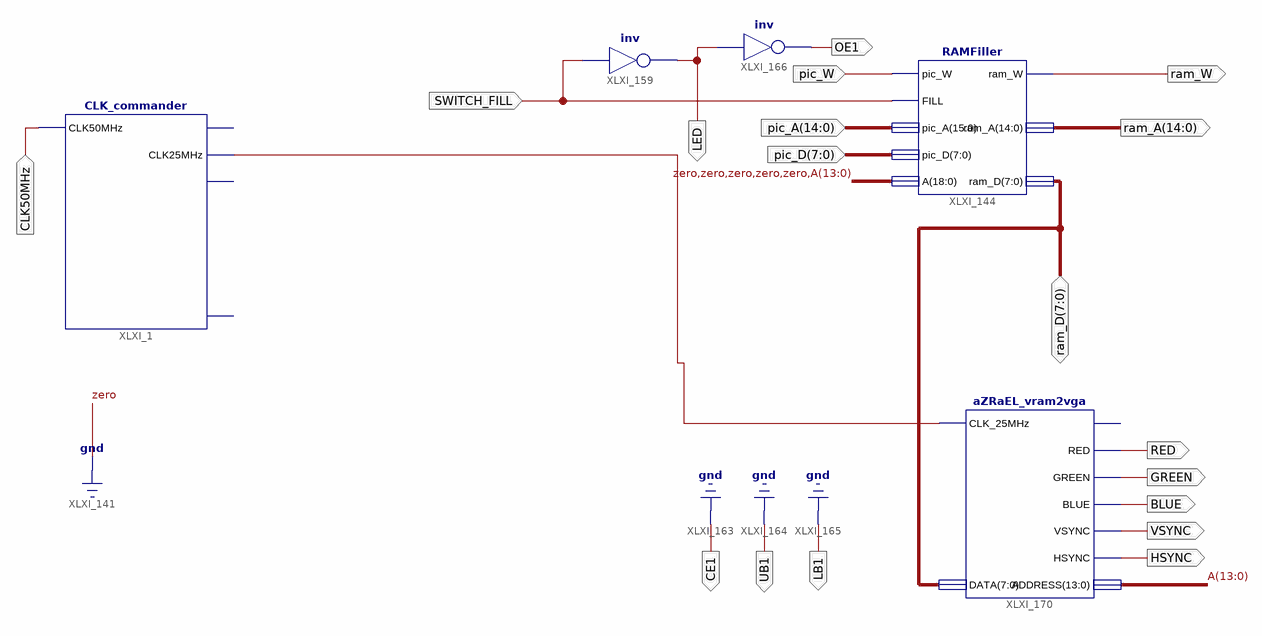
[diagram p0: schematic sheet 1]
// Xilinx ISE schematic externalVRAM2VGA.sch (spartan3) as structural Verilog: 5 symbols, 18 ports
module externalVRAM2VGA (
  input  pic_W,
  input  [14:0] pic_A,
  input  [7:0] pic_D,
  input  CLK50MHz,
  input  SWITCH_FILL,
  inout  [7:0] ram_D,
  output CE1,
  output UB1,
  output LB1,
  output OE1,
  output LED,
  output ram_W,
  output [14:0] ram_A,
  output RED,
  output GREEN,
  output BLUE,
  output VSYNC,
  output HSYNC
);

  wire XLXN_552;
  wire [13:0] A;

  CLK_commander XLXI_1 (.CLK50MHz(CLK50MHz), .CLK25MHz(XLXN_552));  // open: CLK100MHz, CLK1MHz, CLK4MHz
  not XLXI_159 (LED, SWITCH_FILL);
  not XLXI_166 (OE1, LED);
  RAMFiller XLXI_144 (
    .pic_W(pic_W), .FILL(SWITCH_FILL), .pic_A(pic_A), .pic_D(pic_D), .A({{5{1'b0}}, A}), .ram_W(ram_W),
    .ram_A(ram_A), .ram_D(ram_D));
  aZRaEL_vram2vga XLXI_170 (
    .CLK_25MHz(XLXN_552), .DATA(ram_D), .RED(RED), .GREEN(GREEN), .BLUE(BLUE), .VSYNC(VSYNC), .HSYNC(HSYNC),
    .ADDRESS(A));  // open: R

  assign CE1 = 1'b0;
  assign LB1 = 1'b0;
  assign UB1 = 1'b0;
endmodule
